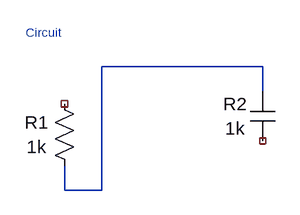
[diagram p0: schematic circuit.asc]
circuit.asc, the LTspice schematic file:
Version 4
SHEET 1 400 288
SYMBOL res 64 128 R0
WINDOW 0 -20 40 Center 2
WINDOW 3 -20 72 Center 2
SYMATTR InstName R1
SYMATTR Value 1k
SYMBOL cap 320 128 R0
WINDOW 0 -20 16 Center 2
WINDOW 3 -20 48 Center 2
SYMATTR InstName R2
SYMATTR Value 1k
WIRE 80 224 80 256
WIRE 80 256 128 256
WIRE 128 96 128 256
WIRE 128 96 336 96
WIRE 336 96 336 128
TEXT 30 52 Left 1 ;Circuit

The netlist it stands for:
* circuit.asc
R1 NC_01 N001 1k
C§R2 N001 NC_02 1k
* Circuit
.backanno
.end